# EAGLE design Schaltplan1 (EAGLE 9.4.2)
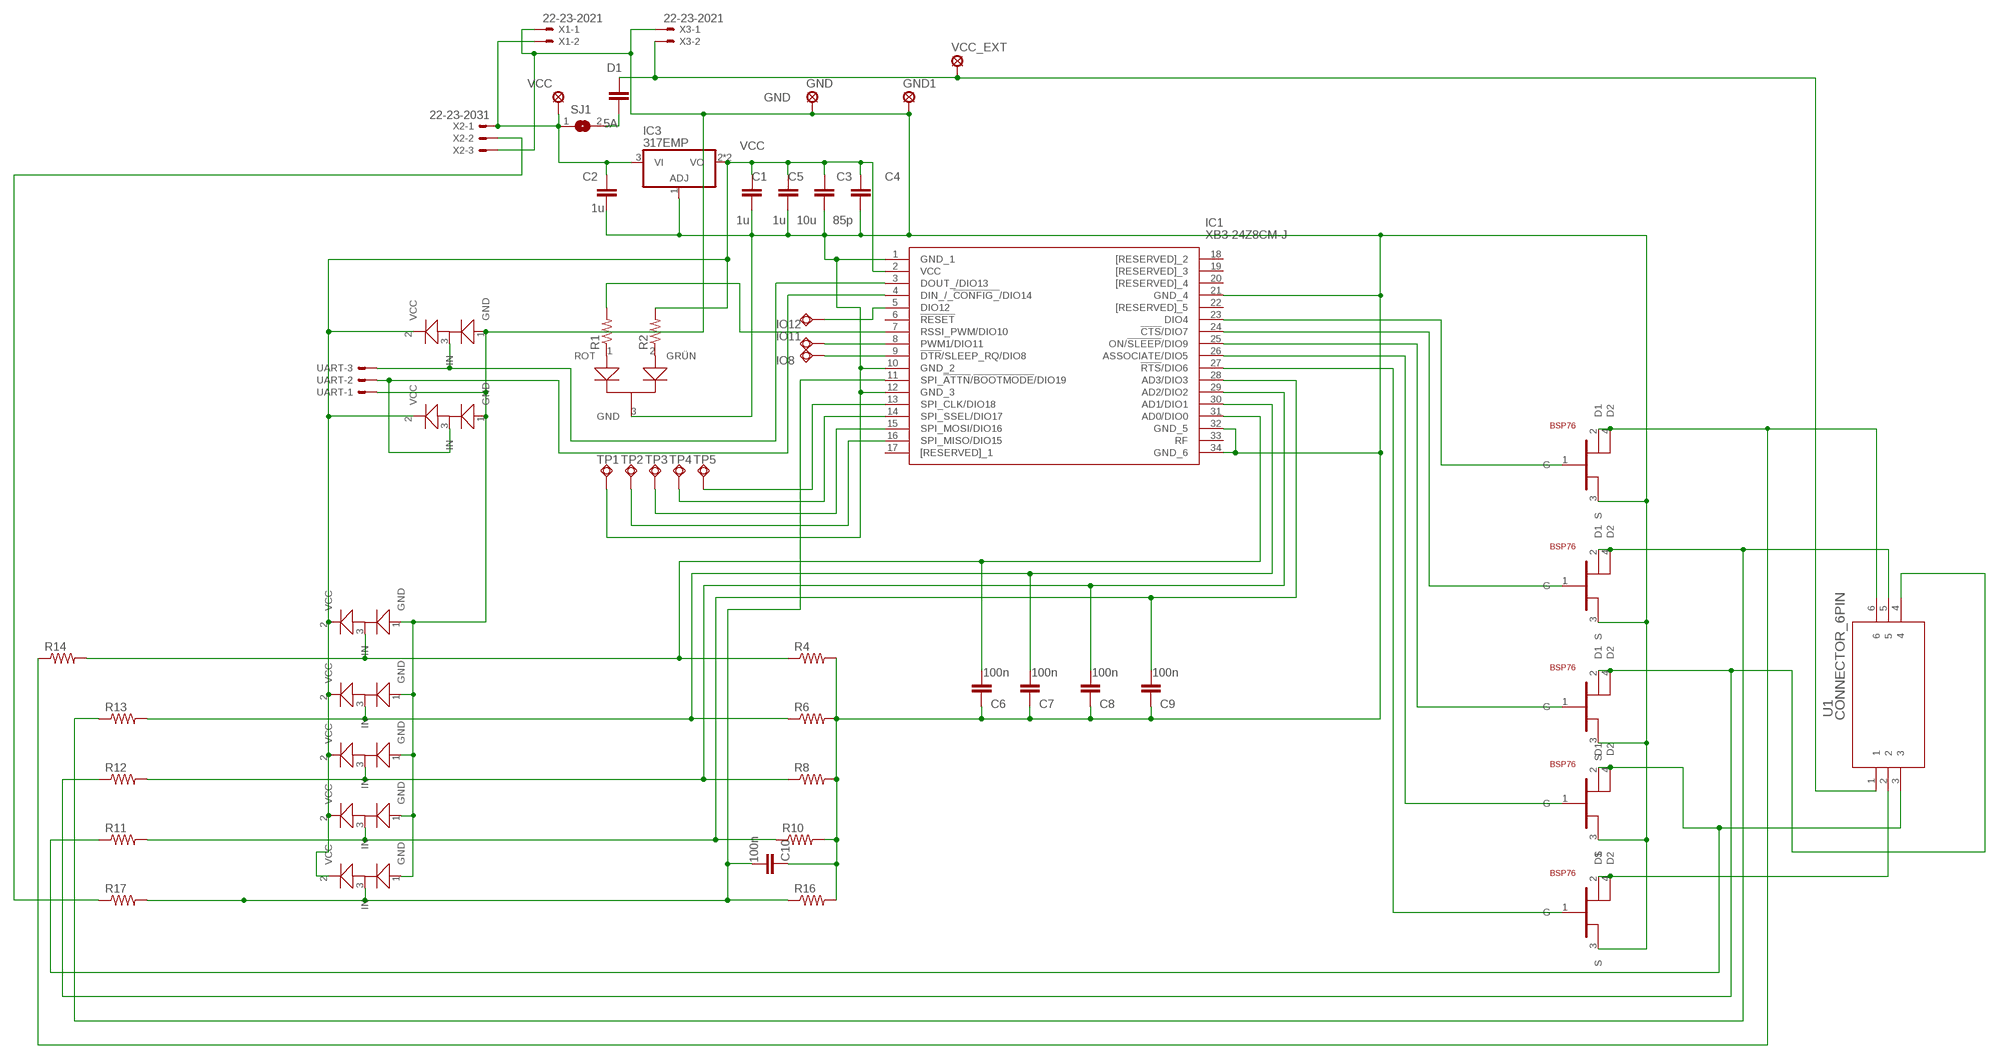
[diagram p0: schematic, sheet 1]

## Parts
C1  1u  CC0805KRX7R9BB104  [CAP_0805]
C2  1u  CC0805KRX7R9BB104  [CAP_0805]
C3  10u  CC0805KRX7R9BB104  [CAP_0805]
C4  85p  CC0805KRX7R9BB104  [CAP_0805]
C5  1u  CC0805KRX7R9BB104  [CAP_0805]
C6  100n  CC0805KRX7R9BB104  [CAP_0805]
C7  100n  CC0805KRX7R9BB104  [CAP_0805]
C8  100n  CC0805KRX7R9BB104  [CAP_0805]
C9  100n  CC0805KRX7R9BB104  [CAP_0805]
C10  100n  CC0805KRX7R9BB104  [CAP_0805]
D1  5A  CC0805KRX7R9BB104  [CAP_0805]
GND  LSP10  [LSP10]
GND1  LSP10  [LSP10]
IC1  XB3-24Z8CM-J  [XB324Z8CMJ]
IC3  317EMP  [SOT223]
IO8  TPSQB1,27  [B1,27]
IO11  TPSQB1,27  [B1,27]
IO12  TPSQB1,27  [B1,27]
LED  LED_RG_SOT23  [SOT23]
R1  150  CRCW08050000Z0EA  [RES_0805]
R2  CRCW08050000Z0EA  [RES_0805]
R4  47k  CRCW08050000Z0EA  [RES_0805]
R6  CRCW08050000Z0EA  [RES_0805]
R8  CRCW08050000Z0EA  [RES_0805]
R10  CRCW08050000Z0EA  [RES_0805]
R11  CRCW08050000Z0EA  [RES_0805]
R12  CRCW08050000Z0EA  [RES_0805]
R13  CRCW08050000Z0EA  [RES_0805]
R14  CRCW08050000Z0EA  [RES_0805]
R16  CRCW08050000Z0EA  [RES_0805]
R17  CRCW08050000Z0EA  [RES_0805]
SJ1  SJW  [SJW]
TP1  TPSQB1,27  [B1,27]
TP2  TPSQB1,27  [B1,27]
TP3  TPSQB1,27  [B1,27]
TP4  TPSQB1,27  [B1,27]
TP5  TPSQB1,27  [B1,27]
U1  CONNECTOR_6PIN  [282836-6]
U$1  BSP76  [SOT223]
U$2  BSP76  [SOT223]
U$3  BSP76  [SOT223]
U$4  BSP76  [SOT223]
U$5  BSP76  [SOT223]
U$6  TVS-DIODE  [SOT23-R]
U$7  TVS-DIODE  [SOT23-R]
U$8  TVS-DIODE  [SOT23-R]
U$9  TVS-DIODE  [SOT23-R]
U$10  TVS-DIODE  [SOT23-R]
U$11  TVS-DIODE  [SOT23-R]
U$12  TVS-DIODE  [SOT23-R]
UART  22-23-2031  [22-23-2031]
VCC  LSP10  [LSP10]
VCC_EXT  LSP10  [LSP10]
X1  22-23-2021  [22-23-2021]
X2  22-23-2031  [22-23-2031]
X3  22-23-2021  [22-23-2021]

## Nets
GND: C1.2 C2.2 C3.1 C4.1 C5.2 C6.1 C7.1 C8.1 C9.1 C10.1 GND1.MP GND.MP IC1.1(GND_1) IC1.10(GND_2) IC1.12(GND_3) IC1.21(GND_4) IC1.32(GND_5) IC1.34(GND_6) IC3.1(ADJ) LED.3(GND) R4.2 R6.2 R8.2 R10.2 R16.2 TP1.TP U$1.3(S) U$2.3(S) U$3.3(S) U$4.3(S) U$5.3(S) U$6.1(GND) U$7.1(GND) U$8.1(GND) U$9.1(GND) U$10.1(GND) U$11.1(GND) U$12.1(GND) UART.1 X1.1 X2.3 X3.1
N$1: C2.1 IC3.3(VI) SJ1.1 VCC.MP X1.2 X2.1
N$3: IC1.5(DIO12) IO12.TP
N$4: IC1.27(!RTS!/DIO6) U$5.1(G)
N$5: IC1.26(ASSOCIATE/DIO5) U$4.1(G)
N$6: IC1.25(ON/!SLEEP!/DIO9) U$3.1(G)
N$7: IC1.24(!CTS!/DIO7) U$2.1(G)
N$8: IC1.23(DIO4) U$1.1(G)
N$13: U1.2 U$5.2(D1) U$5.4(D2)
N$14: R14.1 U1.6 U$1.2(D1) U$1.4(D2)
N$15: IC1.3(DOUT_/DIO13) U$11.3(IN) UART.3
N$16: D1.1 U1.1 VCC_EXT.MP X3.2
N$17: C6.2 IC1.31(AD0/DIO0) R4.1 R14.2 U$7.3(IN)
N$18: C7.2 IC1.30(AD1/DIO1) R6.1 R13.2 U$8.3(IN)
N$19: C8.2 IC1.29(AD2/DIO2) R8.1 R12.2 U$9.3(IN)
N$20: C9.2 IC1.28(AD3/DIO3) R10.1 R11.2 U$10.3(IN)
N$21: IC1.14(SPI_SSEL/DIO17) TP4.TP
N$22: IC1.4(DIN_/_!CONFIG_!/DIO14) U$12.3(IN) UART.2
N$23: D1.2 SJ1.2
N$25: LED.1(ROT) R1.1
N$26: LED.2(GRÜN) R2.1
N$27: IC1.7(RSSI_PWM/DIO10) R1.2
N$28: IC1.13(SPI_CLK/DIO18) TP5.TP
N$29: R13.1 U1.5 U$2.2(D1) U$2.4(D2)
N$30: IC1.16(SPI_MISO/DIO15) TP2.TP
N$31: IC1.15(SPI_MOSI/DIO16) TP3.TP
N$32: R12.1 U1.4 U$3.2(D1) U$3.4(D2)
N$33: C10.2 IC1.11(SPI_!ATTN!/!BOOTMODE!/DIO19) R16.1 R17.2 U$6.3(IN)
N$34: IC1.8(PWM1/DIO11) IO11.TP
N$35: IC1.9(!DTR!/SLEEP_RQ/DIO8) IO8.TP
N$36: R11.1 U1.3 U$4.2(D1) U$4.4(D2)
N$47: R17.1 X2.2
VCC: C1.1 C3.2 C4.2 C5.1 IC1.2(VCC) IC3.2(VO) IC3.4(VO) R2.2 U$6.2(VCC) U$7.2(VCC) U$8.2(VCC) U$9.2(VCC) U$10.2(VCC) U$11.2(VCC) U$12.2(VCC)
Unconnected: IC1.6(!RESET) IC1.17([RESERVED]_1) IC1.18([RESERVED]_2) IC1.19([RESERVED]_3) IC1.20([RESERVED]_4) IC1.22([RESERVED]_5) IC1.33(RF)

## Library data of the parts
C1-C10 D1 = Resistor_Capacitor:CC0805KRX7R9BB104: CAP CER 0.1UF 50V X7R 0805 Manufacturer's datasheet <http://www.yageo.com/documents/recent/UPY-GPHC_X7R_6.3V-to-50V_18.pdf>; CREATED_BY: PCBLayout.com; DIGIKEY_PART_NUMBER: 311-1140-2-ND; MANUFACTURER: Yageo; MPN: CC0805KRX7R9BB104; PACKAGE: SMD 0805
GND GND1 VCC VCC_EXT = solpad:LSP10: SOLDER PAD drill 1.0 mm, distributor Buerklin, 12H555
IC1 = XB3-24Z8CM-J:XB3-24Z8CM-J: Zigbee Modules (802.15.4) XBee3 ,2.4 Ghz ZB 3.0, Chip Ant, MMT Source: Datasheet <https://www.digi.com/resources/documentation/digidocs/pdfs/90001543.pdf>; DESCRIPTION: Zigbee Modules (802.15.4) XBee3 ,2.4 Ghz ZB 3.0, Chip Ant, MMT; HEIGHT: 4mm; MANUFACTURER_NAME: Digi International; MANUFACTURER_PART_NUMBER: XB3-24Z8CM-J; MOUSER_PART_NUMBER: 888-XB3-24Z8CM-J; MOUSER_PRICE-STOCK: https://www.mouser.com/Search/Refine.aspx?Keyword=888-XB3-24Z8CM-J
IC3 = linear:*317: Positive VOLTAGE REGULATOR
IO8 IO11 IO12 TP1-TP5 = testpad:TPSQ: Test pad
LED = ROT_GRÜN_LED_SOT23:LED_RG_SOT23
R1 R2 R4 R6 R8 R10-R14 R16 R17 = Resistor_Capacitor:CRCW08050000Z0EA: RES SMD 0 OHM JUMPER 1/8W 0805 Manufacturer's datasheet <http://www.vishay.com/docs/20035/dcrcwe3.pdf>; CREATED_BY: PCBLayout.com; DIGIKEY_PART_NUMBER: 541-0.0ATR-ND; MANUFACTURER: Vishay Dale; MPN: CRCW08050000Z0EA; PACKAGE: SMD 0805
SJ1 = jumper:SJ: SMD solder JUMPER
U1 = Connector_6pin:CONNECTOR_6PIN; MANUFACTURER_PART_NUMBER: 2828366; VENDOR: TE Connectivity
U$1-U$5 = BSP76:BSP76
U$6-U$12 = TVS:TVS-DIODE
UART X2 = con-molex:22-23-2031: .100" (2.54mm) Center Header - 3 Pin; MF: MOLEX; MPN: 22-23-2031; OC_FARNELL: 1462950; OC_NEWARK: 30C0862
X1 X3 = con-molex:22-23-2021: .100" (2.54mm) Center Header - 2 Pin; MF: MOLEX; MPN: 22-23-2021; OC_FARNELL: 1462926; OC_NEWARK: 25C3832

## Net classes
0 default: clearance 0.205 mm

## Board
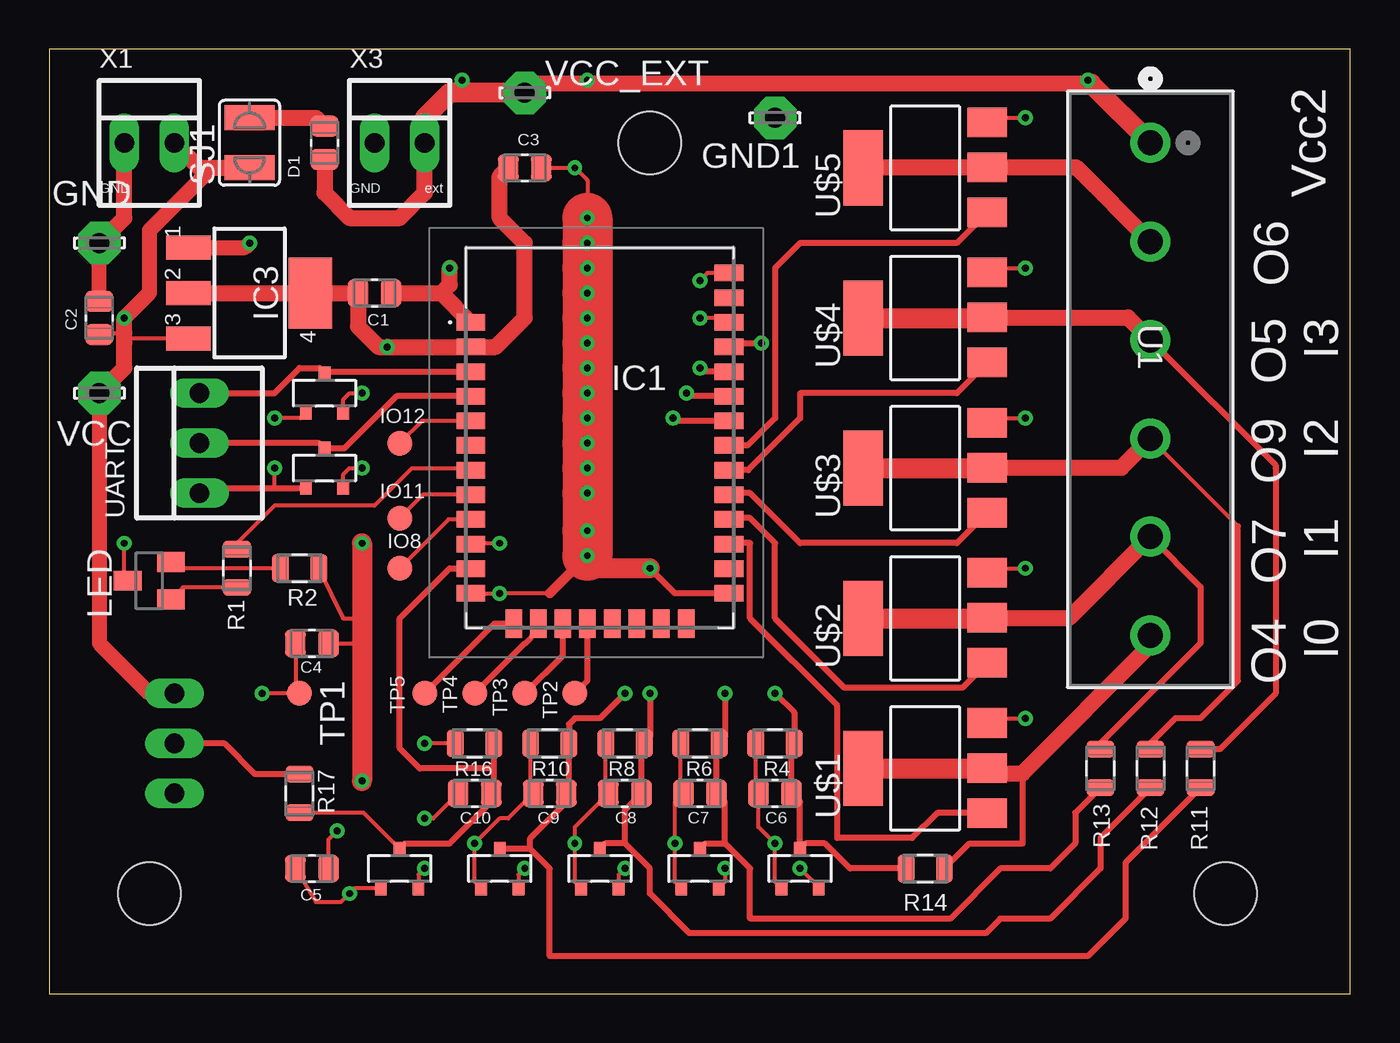
[diagram p1: board, top side]
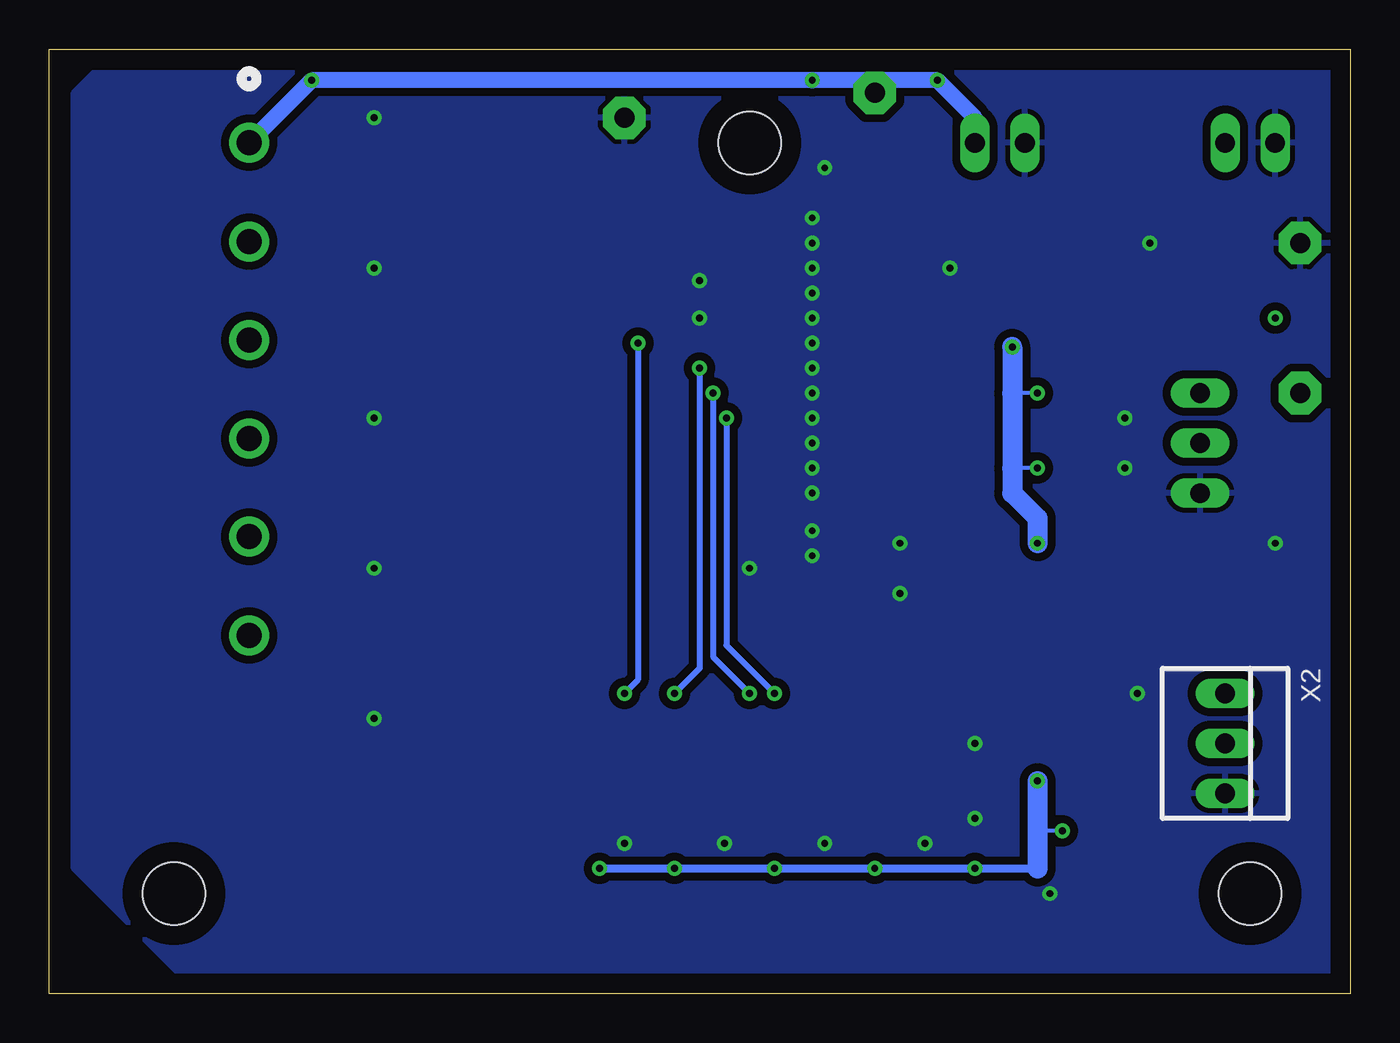
[diagram p2: board, bottom side, seen from below]

Size 66.02 x 47.93 mm. Coordinates in mm from the lower left corner, seen from the top.
Outline: 0,0 66.02,0 66.02,47.93 0,47.93 0,0
Copper layers (1*16): Top 0.035mm / dielectric 1.5mm / Bottom 0.035mm
Design rules "default *": minimum track width 8mil, minimum drill 0.35mm, track to track 6mil, track to pad 6mil, pad to pad 6mil, via to via 6mil, smd to smd 6mil, copper to edge 40mil, drill to drill 6mil, minimum pad ring 10mil, minimum via ring 8mil, stop-mask expansion 4mil, vias tented up to drill 0mil, thermal gap 10mil
Holes 3.17 mm at 30.48,43.18 5.08,5.08 59.69,5.08

### Footprints (pad centres in the part's own frame; a part is rotated, then mirrored left to right if it is on the bottom)
CAP_0805 = smd 1.05 x 1.38: 1 -0.84,0; 2 0.84,0
LSP10 = drill 1.016 pad 2.159 octagon: MP 0,0
XB324Z8CMJ = smd 1.448 x 0.838: 1 -6.553,13.75; 2 -6.553,12.5; 3 -6.553,11.25; 4 -6.553,10; 5 -6.553,8.75; 6 -6.553,7.5; 7 -6.553,6.25; 8 -6.553,5; 9 -6.553,3.75; 10 -6.553,2.5; 11 -6.553,1.25; 12 -6.553,0; 21 6.553,0; 22 6.553,1.25; 23 6.553,2.5; 24 6.553,3.75; 25 6.553,5; 26 6.553,6.25; 27 6.553,7.5; 28 6.553,8.75; 29 6.553,10; 30 6.553,11.25; 31 6.553,12.5; 32 6.553,13.75; 33 6.553,15; 34 6.553,16.25 | smd 0.838 x 1.448: 13 -4.375,-1.537; 14 -3.125,-1.537; 15 -1.875,-1.537; 16 -0.625,-1.537; 17 0.625,-1.537; 18 1.875,-1.537; 19 3.125,-1.537; 20 4.375,-1.537
SOT223 = smd 1.219 x 2.235: 1 -2.311,-3.099; 2 0,-3.099; 3 2.311,-3.099 | smd 3.6 x 2.2: 4 0,3.099
B1,27 = smd 1.27 x 1.27: TP 0,0
SOT23 = smd 1 x 1.4: 1 -0.95,-1.1; 2 0.95,-1.1; 3 0,1.1
RES_0805 = smd 0.87 x 1.42: 1 -0.975,0; 2 0.975,0
SJW = smd 1.27 x 2.54: 1 -1.27,0; 2 1.27,0
282836-6 = drill 1.27 pad 2.032: 1 0,0; 2 5.004,0; 3 10.008,0; 4 15.011,0; 5 19.99,0; 6 24.994,0
SOT223' = smd 1.499 x 2.007: 1 -2.261,-3.15; 2 0.025,-3.15; 3 2.311,-3.15 | smd 3.81 x 2.007: 4 0,3.15
SOT23-R = smd 0.6 x 0.7: 1 -0.95,-1; 2 0.95,-1; 3 0,1
22-23-2031 = drill 1 long: 1 -2.54,0; 2 0,0; 3 2.54,0
22-23-2021 = drill 1 long: 1 -1.27,0; 2 1.27,0

### Placement (x,y rotation side)
C1  16.51,35.56 0 top
C2  2.54,34.29 90 top
C3  24.13,41.91 180 top
C4  13.34,17.78 0 top
C5  13.34,6.35 180 top
C6  36.83,10.16 0 top
C7  33.02,10.16 0 top
C8  29.21,10.16 0 top
C9  25.4,10.16 0 top
C10  21.59,10.16 0 top
D1  13.97,43.18 90 top
GND  2.54,38.1 0 top
GND1  36.83,44.45 180 top
IC1  27.94,20.32 0 top
IC3  10.16,35.56 270 top
IO8  17.78,21.59 0 top
IO11  17.78,24.13 0 top
IO12  17.78,27.94 0 top
LED  5.08,20.95 90 top
R1  9.53,21.59 90 top
R2  12.7,21.59 0 top
R4  36.83,12.7 180 top
R6  33.02,12.7 180 top
R8  29.21,12.7 180 top
R10  25.4,12.7 180 top
R11  58.42,11.43 270 top
R12  55.88,11.43 270 top
R13  53.34,11.43 270 top
R14  44.45,6.35 180 top
R16  21.59,12.7 180 top
R17  12.7,10.16 270 top
SJ1  10.16,43.18 90 top
TP1  12.7,15.24 270 top
TP2  26.67,15.24 270 top
TP3  24.13,15.24 270 top
TP4  21.59,15.24 270 top
TP5  19.05,15.24 270 top
U1  55.88,43.18 270 top
U$1  BSP76  [SOT223']  44.45,11.43 90 top
U$2  BSP76  [SOT223']  44.45,19.05 90 top
U$3  BSP76  [SOT223']  44.45,26.67 90 top
U$4  BSP76  [SOT223']  44.45,34.29 90 top
U$5  BSP76  [SOT223']  44.45,41.91 90 top
U$6  17.78,6.35 0 top
U$7  38.1,6.35 0 top
U$8  33.02,6.35 0 top
U$9  27.94,6.35 0 top
U$10  22.86,6.35 0 top
U$11  13.97,30.48 0 top
U$12  13.97,26.67 0 top
UART  7.62,27.94 90 top
VCC  2.54,30.48 0 top
VCC_EXT  24.13,45.72 0 top
X1  5.08,43.18 0 top
X2  6.35,12.7 270 bottom
X3  17.78,43.18 0 top

### Tracks (layer width: path | path; a pad name or v marks a point on that pad's centre or on a via)
GND  (via drill 0.35)
  Top 0.203: C5.2 13.54,4.65 14.81,4.65 v15.24,5.08 15.51,5.35 U$6.1 | 47.83,44.45 v49.53,44.45 | 47.83,36.83 v49.53,36.83 | 47.83,29.21 v49.53,29.21 | 47.83,13.97 v49.53,13.97 | 47.83,21.59 v49.53,21.59 | U$7.1 36.83,5.67 v36.83,7.62 35.99,8.46 C6.1 35.85,10.3 R4.2 | U$8.1 31.75,5.67 v31.75,7.62 31.75,9.73 C7.1 | U$9.1 26.67,5.67 v26.67,7.62 26.67,8.46 C8.1 | C10.1 19.48,8.89 v19.05,8.89 | R16.2 v19.05,12.7 | 24.43,10.3 R10.2 | 28.23,10.3 R8.2 | 32.05,10.3 R6.2 | C9.1 23.29,8.89 22.86,8.89 v21.59,7.62 21.59,5.67 U$10.1 | U$11.1 12.75,29.21 v11.43,29.21 | 11.43,25.67 v11.43,26.67 | 34.23,36.83 IC1.34 33.4,36.57 v33.02,36.2 | IC1.32 34.27,34.29 v33.02,34.29 | C3.1 v26.67,41.91 27.3,41.27 v27.3,39.37 | LED.3 3.81,21.12 v3.81,22.86 | C4.1 12.49,15.45 TP1.TP v10.79,15.24 | IC1.10 21.43,22.86 v22.86,22.86 | IC1.12 v22.86,20.32 25.4,20.32
  Top 0.305: IC1.21 31.75,20.32 v30.48,21.59 | UART.1 7.89,25.67 11.43,25.67 U$12.1
  Top 0.508: C6.1 35.85,10.02 | 32.05,10.3 C7.1 32.05,10.02 | 28.23,10.3 C8.1 28.23,10.02 | 24.43,10.3 C9.1 | 20.75,12.84 R16.2 | 20.61,10.3 C10.1 | v27.3,22.23 25.4,20.32
  Top 0.762: IC3.1 9.93,37.87 v10.16,38.1 | C2.2 GND.MP
  Top 0.813: GND.MP 3.81,39.37 X1.1 | C1.2 19.9,35.56 | 19.9,35.56 IC1.1 | U$5.3 47.83,44.45 | U$3.3 47.83,29.21 | U$2.3 47.83,21.59 | U$1.3 47.83,13.97 | 47.83,36.83 U$4.3 | 19.9,35.56 20.32,35.98 v20.32,36.83
  Top 1.016: v30.48,21.59 27.94,21.59
  Top 2.54: v27.3,39.37 v27.3,38.1 v27.3,36.83 v27.3,35.56 v27.3,34.29 v27.3,33.02 v27.3,31.75 v27.3,30.48 v27.3,29.21 v27.3,27.94 v27.3,26.67 v27.3,25.4 v27.3,23.49 v27.3,22.23
  pour Bottom (isolate 0.406): 1.27,0 58.42,0 64.77,6.35 64.77,45.72 63.5,46.99 1.27,46.99 0,45.72 0,1.27
N$1  (via drill 0.35)
  Top 0.203: 5.08,15.24 X2.1 | IC3.3 4.04,33.25 3.81,33.02 | C2.1 2.62,33.53 3.81,33.53
  Top 0.762: 8.26,41.91 5.08,38.73 5.08,35.56 v3.81,34.29 | VCC.MP 2.54,17.78 5.08,15.24
  Top 0.813: X1.2 7.62,41.91 8.26,41.91 SJ1.1 | VCC.MP 3.81,31.75 3.81,33.02 3.81,33.53 v3.81,34.29
N$3
  Top 0.203: IC1.5 18.91,29.07 IO12.TP
N$4
  Top 0.305: U$5.1 46.05,38.1 38.1,38.1 36.83,36.83 36.83,29.21 35.44,27.82 IC1.27
N$5
  Top 0.305: U$4.1 46.05,30.48 38.1,30.48 38.1,29.21 35.46,26.57 IC1.26
N$6
  Top 0.305: U$3.1 46.05,22.86 38.1,22.86 35.56,25.4 34.57,25.4 IC1.25
N$7
  Top 0.305: U$2.1 46.33,15.52 40.36,15.52 36.83,19.05 36.83,22.86 35.56,24.13 34.55,24.13 IC1.24
N$8
  Top 0.305: U$1.1 45.06,9.17 43.79,7.9 39.99,7.9 39.99,14.62 35.56,19.05 35.56,22.86 34.53,22.86 IC1.23
N$13
  Top 0.813: U$5.4 41.33,41.94 U$5.2 52.12,41.94 U1.2
N$14
  Top 0.305: R14.1 46.7,7.62 49.4,7.62 49.4,11.16
  Top 0.813: 47.57,11.43 U$1.2 47.89,11.16 49.36,11.16 | U1.6 55.88,17.68 49.36,11.16 | 49.4,11.16 49.36,11.16
  Top 1.016: U$1.4 47.57,11.43
N$15
  Top 0.305: UART.3 11.43,30.48 12.7,31.75 13.7,31.75 U$11.3 14.06,31.57 IC1.3
N$16  (via drill 0.35)
  Top 0.813: D1.1 13.97,40.64 15.24,39.37 17.78,39.37 19.05,40.64 X3.2 19.05,44.45 | 52.87,46.19 24.6,46.19 VCC_EXT.MP
  Top 1.016: VCC_EXT.MP 20.32,45.72 19.05,44.45 | 52.87,46.19 U1.1
  Bottom 0.813: X3.2 19.05,44.45 v20.95,46.35 v27.3,46.35 v52.7,46.35 U1.1
N$17  (via drill 0.35)
  Top 0.305: R14.2 40.64,6.35 39.37,7.62 38.37,7.62 U$7.3 38.1,9.73 C6.2 37.67,12.57 R4.1 37.8,14.27 v36.83,15.24 | IC1.31 34.69,33.02 v36.15,33.02
  Bottom 0.305: v36.15,33.02 36.15,15.92 v36.83,15.24
N$18  (via drill 0.35)
  Top 0.305: R13.2 52.07,9.18 52.07,7.62 50.8,6.35 48.26,6.35 45.72,3.81 35.56,3.81 35.56,6.35 34.29,7.62 | 34.29,7.62 33.29,7.62 U$8.3 | IC1.30 33.2,31.57 v33.02,31.75 | v34.29,15.24 34.29,13 R6.1 | 34.29,7.62 34.29,9.73 C7.2 33.86,12.57
  Top 0.508: 33.86,12.57 R6.1
  Bottom 0.305: v33.02,31.75 33.02,16.51 v34.29,15.24
N$19  (via drill 0.35)
  Top 0.305: R12.2 53.34,7.91 53.34,6.35 50.8,3.81 48.26,3.81 47.52,3.07 32.49,3.07 30.48,5.08 30.48,6.35 29.21,7.62 | 29.21,7.62 28.21,7.62 U$9.3 | IC1.29 32.5,30.32 v32.34,30.48 | v30.48,15.24 30.48,13 R8.1 30.05,12.57 C8.2 | 29.21,7.62 29.21,9.32 30.18,10.3
  Top 0.508: 30.18,10.3 C8.2
  Bottom 0.305: v32.34,30.48 32.34,17.1 v30.48,15.24
N$20  (via drill 0.35)
  Top 0.305: R11.2 54.61,6.64 54.61,3.81 52.7,1.91 25.4,1.91 25.4,6.35 24.4,7.35 | 24.4,7.35 U$10.3 | IC1.28 31.79,29.07 v31.65,29.21 | v29.21,15.24 27.94,13.97 26.67,13.97 26.38,13.68 R10.1 26.38,10.3 26.38,9.87 24.4,7.89 24.4,7.35
  Top 0.508: 26.38,10.3 C9.2
  Bottom 0.305: v31.65,29.21 31.65,17.68 v29.21,15.24
N$21
  Top 0.305: TP4.TP 24.1,17.75 24.11,17.75 24.82,18.46 IC1.14
N$22
  Top 0.305: IC1.4 17.62,30.32 14.97,27.67 U$12.3 13.7,27.94 UART.2
N$23
  Top 0.813: SJ1.2 13.54,44.45 D1.2
N$25
  Top 0.203: R1.1 6.79,20.62 LED.1
N$26
  Top 0.203: R2.1 6.5,21.59 LED.2
N$27
  Top 0.203: IC1.7 21.29,26.67 18.41,26.67 16.51,24.77 11.43,24.77 9.53,22.86 R1.2
N$28
  Top 0.305: TP5.TP 22.59,18.78 IC1.13
N$29
  Top 0.305: R13.1 53.34,12.7 58.42,17.78 58.42,20.65 U1.5
  Top 0.813: 48.26,19.05 48.23,19.07 U$2.2 51.77,19.07 U1.5
  Top 1.016: U$2.4 48.26,19.05
N$30
  Top 0.305: TP2.TP 27.32,15.89 IC1.16
N$31
  Top 0.305: TP3.TP 26.07,17.18 IC1.15
N$32
  Top 0.203: 56.13,12.95 56.13,12.66 R12.1 55.88,12.7 | 60.33,23.72 U1.4
  Top 0.305: 60.33,23.72 60.33,15.88 58.42,13.97 57.15,13.97 56.13,12.95 55.88,12.7
  Top 0.813: 48.26,26.67 48.23,26.7 U$3.2 54.41,26.7 U1.4
  Top 1.016: U$3.4 48.26,26.67
N$33
  Top 0.203: U$6.3 15.95,9.18 R17.2
  Top 0.305: U$6.3 18.05,7.62 20.32,7.62 22.43,9.73 C10.2 | 22.57,10.3 22.57,11.43 | 22.57,11.43 R16.1 | 22.57,11.43 18.8,11.43 17.78,12.45 17.78,19.05 20.32,21.59 21.37,21.59 IC1.11
  Top 0.508: 22.57,10.3 C10.2
N$34
  Top 0.203: IC1.8 18.97,25.32 IO11.TP
N$35
  Top 0.203: IC1.9 20.26,24.07 IO8.TP
N$36
  Top 0.305: R11.1 59.4,12.41 62.23,15.24 62.23,26.67 62.23,26.82 U1.3
  Top 0.813: 47.57,34.29 U$4.2 54.74,34.31 U1.3
  Top 1.016: U$4.4 47.57,34.29
N$47
  Top 0.305: R17.1 10.46,11.14 8.89,12.7 X2.2
VCC  (via drill 0.35)
  Top 0.203: v34.29,6.35 34.29,5.67 U$8.2 | v29.21,6.35 28.89,6.03 U$9.2 | v24.13,6.35 23.81,6.03 U$10.2 | v19.05,6.35 18.73,6.03 U$6.2 | U$7.2 39.05,5.4 v38.1,6.35 | U$11.2 14.92,30.16 15.24,30.48 v15.88,30.48 | U$12.2 14.92,26.35 15.24,26.67 v15.88,26.67 | R2.2 14.9,19.05 15.88,19.05 | C5.1 14.18,7.82 v14.61,8.25 | C4.2 15.88,17.78
  Top 0.813: IC3.2 IC3.4 C1.1 15.67,33.86 16.71,32.82 v17.14,32.82 IC1.2 22.66,32.82 24.13,34.29 24.13,38.1 22.86,39.37 22.86,41.48 C3.2
  Top 1.016: v15.88,22.86 15.88,19.05 15.88,17.78 v15.88,10.8
  Bottom 0.203: v15.88,30.48 17.14,30.48 | v15.88,26.67 17.14,26.67 | v14.61,8.25 15.88,8.25
  Bottom 0.406: v38.1,6.35 v34.29,6.35 v29.21,6.35 v24.13,6.35 v19.05,6.35 15.88,6.35
  Bottom 1.016: v17.14,32.82 17.14,30.48 17.14,26.67 17.14,25.4 15.88,24.13 v15.88,22.86 | v15.88,10.8 15.88,8.25 15.88,6.35

### Text on the board
tNames: Vcc2 | GND | GND | ext | O6 | O5 / I3 | O9 / I2 | O7 / I1 | O4 / I0